# EAGLE schematic Full Circuit (EAGLE 8.2.1)
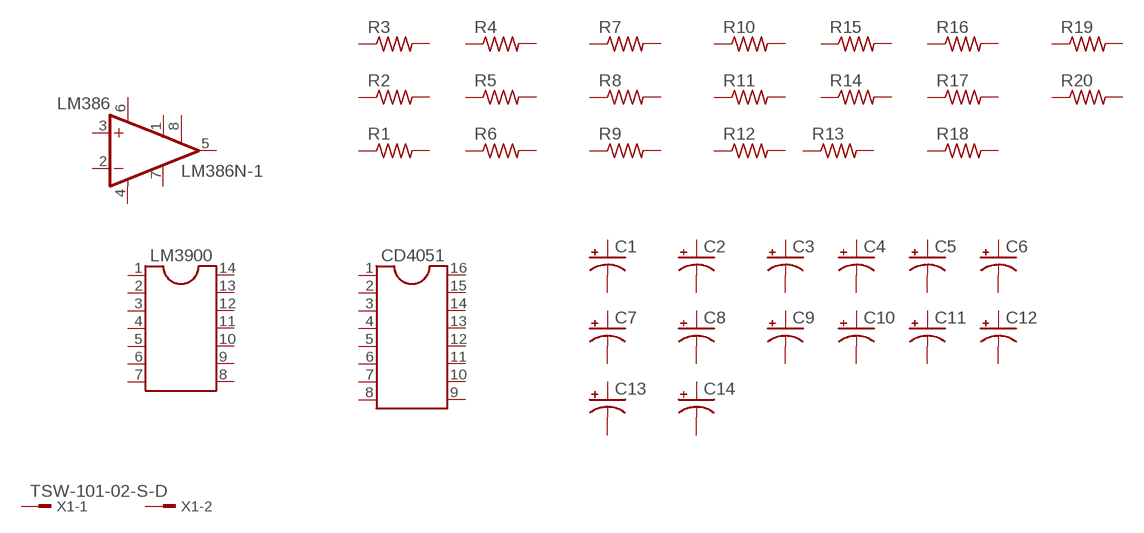
[diagram p0: schematic, sheet 1]

## Parts
C1  CPOL-USE5-4  [E5-4]
C2  CPOL-USE5-4  [E5-4]
C3  CPOL-USE5-4  [E5-4]
C4  CPOL-USE5-4  [E5-4]
C5  CPOL-USE5-4  [E5-4]
C6  CPOL-USE5-4  [E5-4]
C7  CPOL-USE5-4  [E5-4]
C8  CPOL-USE5-4  [E5-4]
C9  CPOL-USE5-4  [E5-4]
C10  CPOL-USE5-4  [E5-4]
C11  CPOL-USE5-4  [E5-4]
C12  CPOL-USE5-4  [E5-4]
C13  CPOL-USE5-4  [E5-4]
C14  CPOL-USE5-4  [E5-4]
CD4051  DIL16  [DIL16]
LM386  LM386N-1  [DIL08]
LM3900  DIL14  [DIL14]
R1  R-US_0207/7  [0207/7]
R2  R-US_0207/7  [0207/7]
R3  R-US_0207/7  [0207/7]
R4  R-US_0207/7  [0207/7]
R5  R-US_0207/7  [0207/7]
R6  R-US_0207/7  [0207/7]
R7  R-US_0207/7  [0207/7]
R8  R-US_0207/7  [0207/7]
R9  R-US_0207/7  [0207/7]
R10  R-US_0207/7  [0207/7]
R11  R-US_0207/7  [0207/7]
R12  R-US_0207/7  [0207/7]
R13  R-US_0207/7  [0207/7]
R14  R-US_0207/7  [0207/7]
R15  R-US_0207/7  [0207/7]
R16  R-US_0207/7  [0207/7]
R17  R-US_0207/7  [0207/7]
R18  R-US_0207/7  [0207/7]
R19  R-US_0207/7  [0207/7]
R20  R-US_0207/7  [0207/7]
X1  TSW-101-02-S-D  [TSW-101-02-S-D]
Unconnected: C1.+ C1.- C2.+ C2.- C3.+ C3.- C4.+ C4.- C5.+ C5.- C6.+ C6.- C7.+ C7.- C8.+ C8.- C9.+ C9.- C10.+ C10.- C11.+ C11.- C12.+ C12.- C13.+ C13.- C14.+ C14.- CD4051.1 CD4051.2 CD4051.3 CD4051.4 CD4051.5 CD4051.6 CD4051.7 CD4051.8 CD4051.9 CD4051.10 CD4051.11 CD4051.12 CD4051.13 CD4051.14 CD4051.15 CD4051.16 LM386.1(GAIN) LM386.2(-IN) LM386.3(+IN) LM386.5(OUT) LM386.7(BYPASS) LM386.8(GAIN) LM3900.1 LM3900.2 LM3900.3 LM3900.4 LM3900.5 LM3900.6 LM3900.7 LM3900.8 LM3900.9 LM3900.10 LM3900.11 LM3900.12 LM3900.13 LM3900.14 R1.1 R1.2 R2.1 R2.2 R3.1 R3.2 R4.1 R4.2 R5.1 R5.2 R6.1 R6.2 R7.1 R7.2 R8.1 R8.2 R9.1 R9.2 R10.1 R10.2 R11.1 R11.2 R12.1 R12.2 R13.1 R13.2 R14.1 R14.2 R15.1 R15.2 R16.1 R16.2 R17.1 R17.2 R18.1 R18.2 R19.1 R19.2 R20.1 R20.2 X1.1 X1.2

## Power pins joined to a net without a drawn wire
GND: LM386.4(GND)
VS: LM386.6(VS)

## Library data of the parts
C1-C14 = rcl:CPOL-US: POLARIZED CAPACITOR, American symbol
CD4051 = ic-package:DIL16: Dual In Line / Socket
LM386 = linear:LM386?-*: Low Voltage Audio Power Amplifier Source: http://cache.national.com/ds/LM/LM386.pdf
LM3900 = ic-package:DIL14: Dual In Line / Socket
R1-R20 = resistor:R-US_: RESISTOR, American symbol
X1 = con-samtec:TSW-101-02-S-D: THROUGH-HOLE .025" SQ POST HEADER Source: Samtec TSW.pdf